# Altium schematic sheet Ferrite.SchDoc
size A3; SheetNumber: 22; SheetTotal: 25
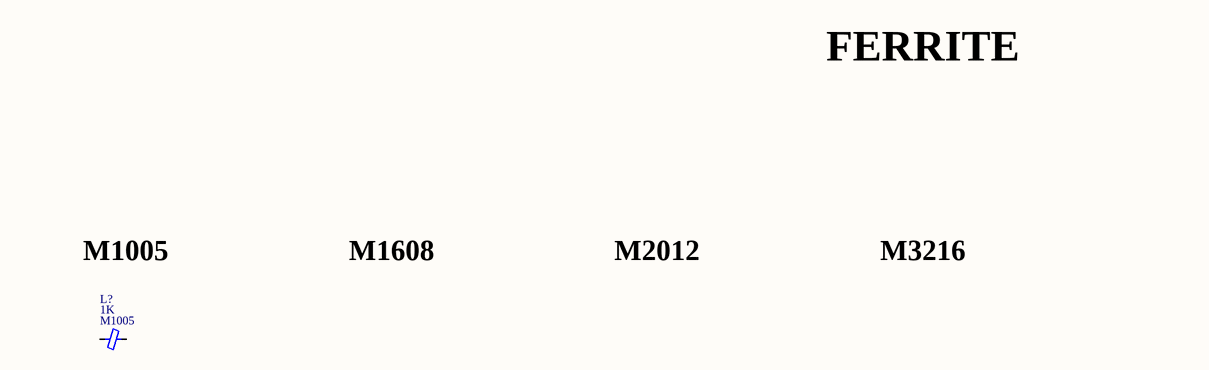
[diagram p0: Ferrite.SchDoc]

## Parts
L?  value 1K  Package: M1005  [Ferrite_Bead_Smd_M1005_I0402]  (hidden comment: Ferrite Bead)

## Nets

Not connected (* = marked no-connect by the designer): L? 1 2

## Notes on the sheet
- FERRITE
- (near L?) M1005
- M1608
- M2012
- M3216

## Library data of the parts
L? = Ferrite Bead: Manufacturer Part Number: WLBD1005K2U102TP; Manufacturer: Walsin; Component Category: Inductor; ComponentLink1Description: Datasheet; ComponentLink1URL: E:\Altium\Datasheets\Inductor\Walsin, WLBD1005-WLBD4532 Chip Bead Series.pdf; ComponentLink2Description: Supplier Link; ComponentLink2URL: https://www.digikey.com/en/products/detail/walsin-technology-corporation/WLBD1005K2U102TP/14563847; Supplier: Digikey; Supplier Part Number: 1292-WLBD1005K2U102TPCT-ND; Operating Temperature, Min: -55℃; Operating Temperature, Max: +125℃; Quantity, Min: 1; Quantity, Max: 50000; Price, Min: 0.1; Price, Max: 0.0021; Supplier Currency: $; Supplier Link: https://www.digikey.com/en/products/detail/walsin-technology-corporation/WLBD1005K2U102TP/14563847; Component Type: Ferrite Bead